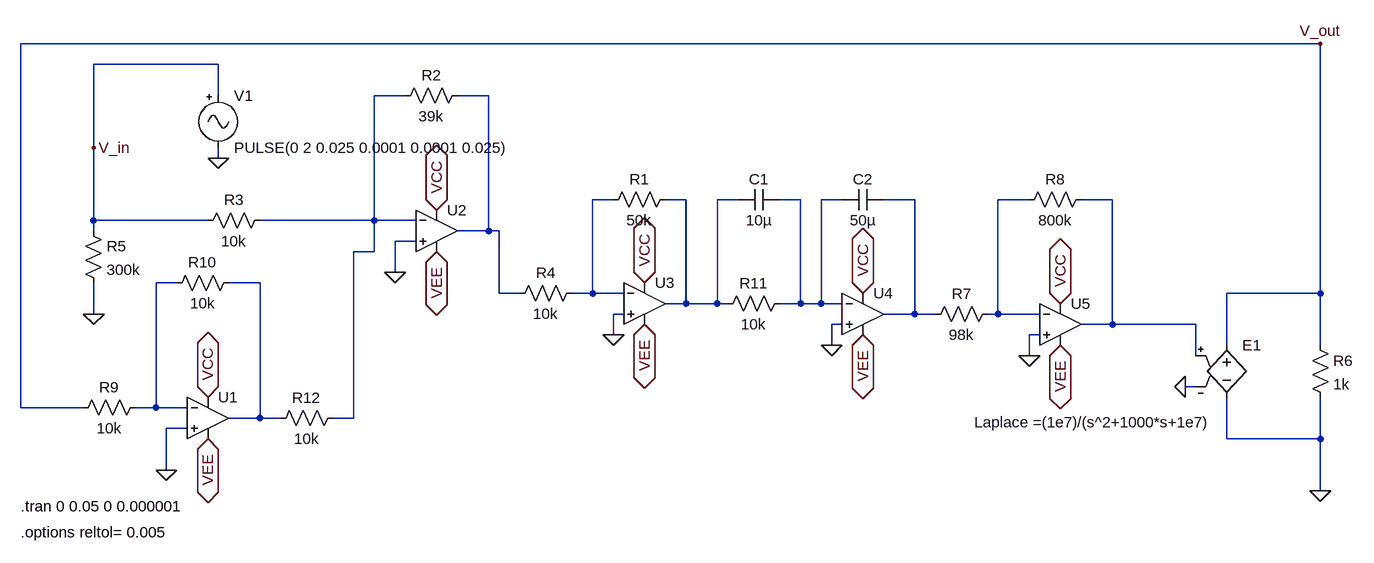
[diagram p0: schematic CircuitoPID.asc]
CircuitoPID.asc, the LTspice schematic file:
Version 4.1
SHEET 1 1480 1128
WIRE 848 -80 -1152 -80
WIRE -848 -48 -1040 -48
WIRE -848 0 -848 -48
WIRE -560 0 -608 0
WIRE -432 0 -480 0
WIRE -1040 80 -1040 -48
WIRE -848 96 -848 80
WIRE -240 160 -272 160
WIRE -128 160 -160 160
WIRE -48 160 -80 160
WIRE 48 160 16 160
WIRE 112 160 80 160
WIRE 224 160 176 160
WIRE 400 160 352 160
WIRE 528 160 480 160
WIRE -1040 192 -1040 80
WIRE -864 192 -1040 192
WIRE -608 192 -608 0
WIRE -608 192 -784 192
WIRE -544 192 -608 192
WIRE -1040 208 -1040 192
WIRE -432 208 -432 0
WIRE -432 208 -480 208
WIRE -416 208 -432 208
WIRE -544 224 -576 224
WIRE -608 240 -608 192
WIRE -608 240 -640 240
WIRE -576 272 -576 224
WIRE -912 288 -944 288
WIRE -784 288 -832 288
WIRE -416 304 -416 208
WIRE -384 304 -416 304
WIRE -272 304 -272 160
WIRE -272 304 -304 304
WIRE -224 304 -272 304
WIRE 848 304 848 -80
WIRE 848 304 704 304
WIRE -128 320 -128 160
WIRE -128 320 -160 320
WIRE -80 320 -80 160
WIRE -80 320 -128 320
WIRE -64 320 -80 320
WIRE 48 320 48 160
WIRE 48 320 16 320
WIRE 80 320 80 160
WIRE 80 320 48 320
WIRE 112 320 80 320
WIRE -1040 336 -1040 288
WIRE -224 336 -240 336
WIRE 224 336 224 160
WIRE 224 336 176 336
WIRE 256 336 224 336
WIRE 352 336 352 160
WIRE 352 336 336 336
WIRE 416 336 352 336
WIRE 112 352 96 352
WIRE 528 352 528 160
WIRE 528 352 480 352
WIRE 656 352 528 352
WIRE -240 368 -240 336
WIRE 416 368 400 368
WIRE 96 384 96 352
WIRE 704 384 704 304
WIRE 848 384 848 304
WIRE 400 400 400 368
WIRE 656 400 656 352
WIRE 656 448 640 448
WIRE -1152 480 -1152 -80
WIRE -1056 480 -1152 480
WIRE -944 480 -944 288
WIRE -944 480 -976 480
WIRE -896 480 -944 480
WIRE -784 496 -784 288
WIRE -784 496 -832 496
WIRE -752 496 -784 496
WIRE -640 496 -640 240
WIRE -640 496 -672 496
WIRE -896 512 -928 512
WIRE 704 528 704 464
WIRE 848 528 848 464
WIRE 848 528 704 528
WIRE -928 576 -928 512
WIRE 848 608 848 528
FLAG -1040 336 0
FLAG -576 272 0
FLAG -240 368 0
FLAG 96 384 0
FLAG 400 400 0
FLAG 848 608 0
FLAG -928 576 0
FLAG -848 96 0
FLAG 640 448 0
FLAG -512 240 VEE
IOPIN -512 240 BiDir
FLAG -192 352 VEE
IOPIN -192 352 BiDir
FLAG 144 368 VEE
IOPIN 144 368 BiDir
FLAG 448 384 VEE
IOPIN 448 384 BiDir
FLAG -864 528 VEE
IOPIN -864 528 BiDir
FLAG -192 288 VCC
IOPIN -192 288 BiDir
FLAG 144 304 VCC
IOPIN 144 304 BiDir
FLAG 448 320 VCC
IOPIN 448 320 BiDir
FLAG -864 464 VCC
IOPIN -864 464 BiDir
FLAG -512 176 VCC
IOPIN -512 176 BiDir
FLAG 848 -80 V_out
FLAG -1040 80 V_in
SYMBOL res -144 144 R90
WINDOW 0 0 56 VBottom 2
WINDOW 3 32 56 VTop 2
SYMATTR InstName R1
SYMATTR Value 50k
SYMBOL res -464 -16 R90
WINDOW 0 0 56 VBottom 2
WINDOW 3 32 56 VTop 2
SYMATTR InstName R2
SYMATTR Value 39k
SYMBOL res -768 176 R90
WINDOW 0 0 56 VBottom 2
WINDOW 3 32 56 VTop 2
SYMATTR InstName R3
SYMATTR Value 10k
SYMBOL res -288 288 R90
WINDOW 0 0 56 VBottom 2
WINDOW 3 32 56 VTop 2
SYMATTR InstName R4
SYMATTR Value 10k
SYMBOL res -1056 192 R0
SYMATTR InstName R5
SYMATTR Value 300k
SYMBOL res 832 368 R0
SYMATTR InstName R6
SYMATTR Value 1k
SYMBOL res 352 320 R90
WINDOW 0 0 56 VBottom 2
WINDOW 3 32 56 VTop 2
SYMATTR InstName R7
SYMATTR Value 98k
SYMBOL res 496 144 R90
WINDOW 0 0 56 VBottom 2
WINDOW 3 32 56 VTop 2
SYMATTR InstName R8
SYMATTR Value 800k
SYMBOL res -960 464 R90
WINDOW 0 0 56 VBottom 2
WINDOW 3 32 56 VTop 2
SYMATTR InstName R9
SYMATTR Value 10k
SYMBOL res -816 272 R90
WINDOW 0 0 56 VBottom 2
WINDOW 3 32 56 VTop 2
SYMATTR InstName R10
SYMATTR Value 10k
SYMBOL res 32 304 R90
WINDOW 0 0 56 VBottom 2
WINDOW 3 32 56 VTop 2
SYMATTR InstName R11
SYMATTR Value 10k
SYMBOL res -656 480 R90
WINDOW 0 0 56 VBottom 2
WINDOW 3 32 56 VTop 2
SYMATTR InstName R12
SYMATTR Value 10k
SYMBOL cap 16 144 R90
WINDOW 0 0 32 VBottom 2
WINDOW 3 32 32 VTop 2
SYMATTR InstName C1
SYMATTR Value 10µ
SYMBOL cap 176 144 R90
WINDOW 0 0 32 VBottom 2
WINDOW 3 32 32 VTop 2
SYMATTR InstName C2
SYMATTR Value 50µ
SYMBOL e 704 368 R0
WINDOW 3 -205 150 Bottom 2
SYMATTR Value Laplace =(1e7)/(s^2+1000*s+1e7)
SYMATTR InstName E1
SYMBOL Misc\\signal -848 -16 R0
WINDOW 123 0 0 Left 0
WINDOW 39 24 132 Left 2
SYMATTR InstName V1
SYMATTR Value PULSE(0 2 0.025 0.0001 0.0001 0.025)
SYMBOL OpAmps\\UniversalOpAmp2 -864 496 R0
SYMATTR InstName U1
SYMBOL OpAmps\\UniversalOpAmp2 -512 208 R0
SYMATTR InstName U2
SYMBOL OpAmps\\UniversalOpAmp2 -192 320 R0
SYMATTR InstName U3
SYMBOL OpAmps\\UniversalOpAmp2 144 336 R0
SYMATTR InstName U4
SYMBOL OpAmps\\UniversalOpAmp2 448 352 R0
SYMATTR InstName U5
TEXT -1152 632 Left 2 !.tran 0 0.05 0 0.000001
TEXT -1152 672 Left 2 !.options reltol= 0.005

The netlist it stands for:
* CircuitoPID.asc
R1 N004 N003 50k
R2 N002 N001 39k
R3 N001 V_in 10k
R4 N003 N002 10k
R5 V_in 0 300k
R6 V_out 0 1k
R7 N007 N006 98k
R8 N008 N007 800k
R9 N009 V_out 10k
R10 N010 N009 10k
R11 N005 N004 10k
R12 N001 N010 10k
C1 N005 N004 10µ
C2 N006 N005 50µ
E1 V_out 0 N008 0 Laplace =(1e7)/(s^2+1000*s+1e7)
V1 V_in 0 PULSE(0 2 0.025 0.0001 0.0001 0.025)
X§U1 0 N009 VCC VEE N010 level2 Avol=1Meg GBW=10Meg Slew=10Meg Ilimit=25m Rail=0 Vos=0 En=0 Enk=0 In=0 Ink=0 Rin=500Meg  ; pins In+ In- V+ V- OUT
X§U2 0 N001 VCC VEE N002 level2 Avol=1Meg GBW=10Meg Slew=10Meg Ilimit=25m Rail=0 Vos=0 En=0 Enk=0 In=0 Ink=0 Rin=500Meg  ; pins In+ In- V+ V- OUT
X§U3 0 N003 VCC VEE N004 level2 Avol=1Meg GBW=10Meg Slew=10Meg Ilimit=25m Rail=0 Vos=0 En=0 Enk=0 In=0 Ink=0 Rin=500Meg  ; pins In+ In- V+ V- OUT
X§U4 0 N005 VCC VEE N006 level2 Avol=1Meg GBW=10Meg Slew=10Meg Ilimit=25m Rail=0 Vos=0 En=0 Enk=0 In=0 Ink=0 Rin=500Meg  ; pins In+ In- V+ V- OUT
X§U5 0 N007 VCC VEE N008 level2 Avol=1Meg GBW=10Meg Slew=10Meg Ilimit=25m Rail=0 Vos=0 En=0 Enk=0 In=0 Ink=0 Rin=500Meg  ; pins In+ In- V+ V- OUT
.tran 0 0.05 0 0.000001
.options reltol= 0.005
.lib UniversalOpAmp2.lib
.backanno
.end